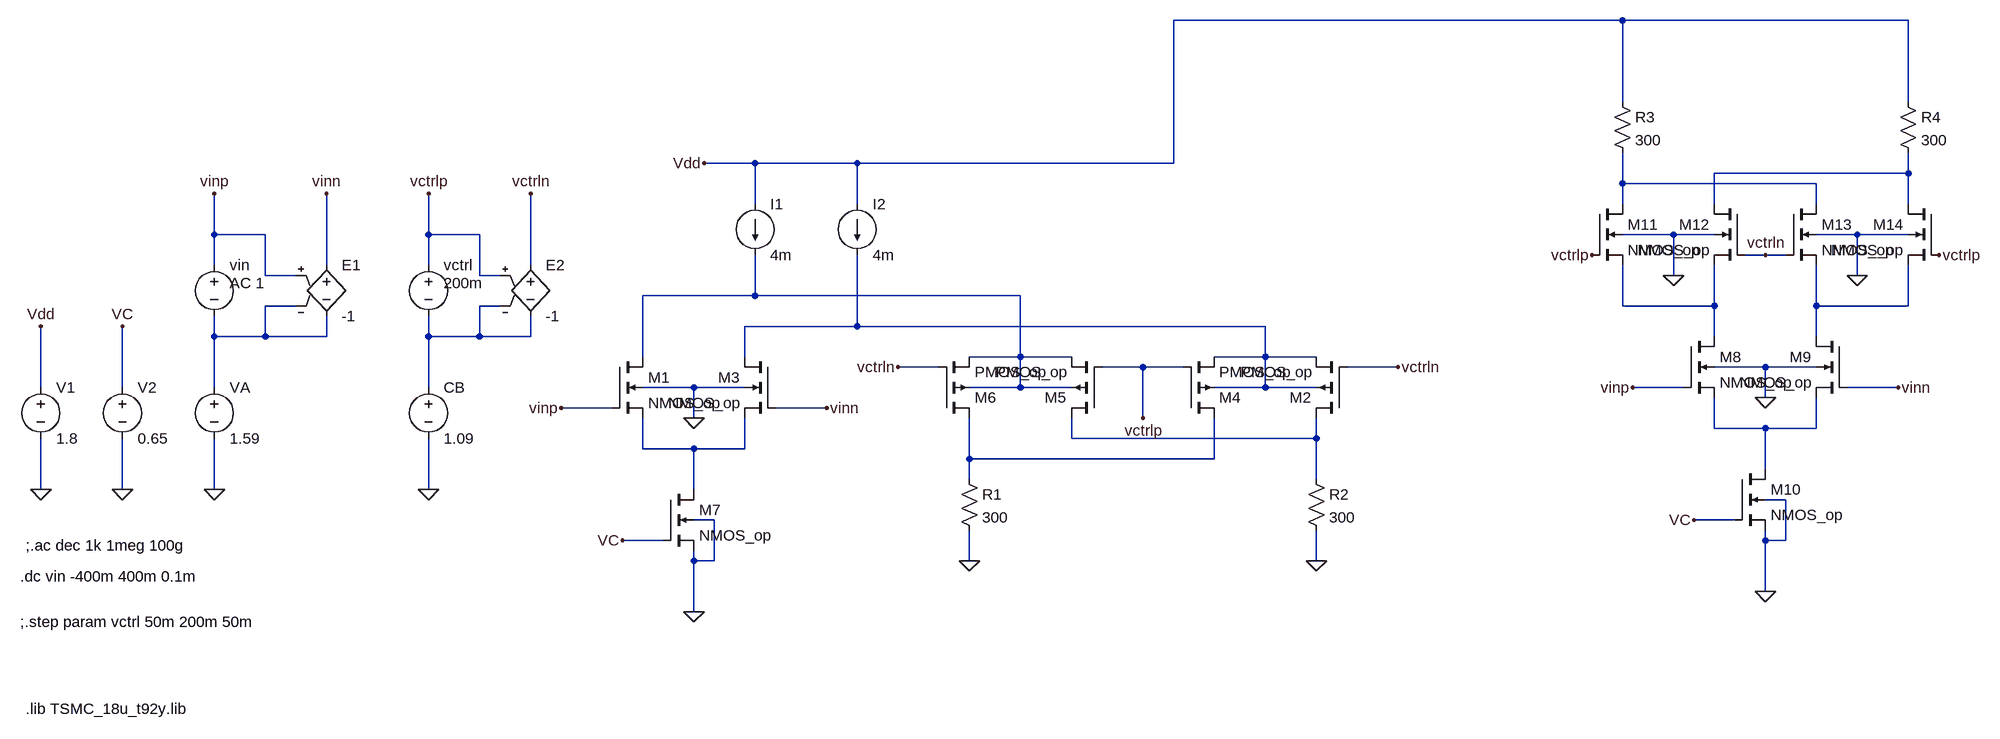
[diagram p0: schematic Draft1.asc]
Draft1.asc, the LTspice schematic file:
Version 4
SHEET 1 2292 680
WIRE 1648 -432 944 -432
WIRE 2096 -432 1648 -432
WIRE 1648 -304 1648 -432
WIRE 2096 -304 2096 -432
WIRE 288 -208 208 -208
WIRE 448 -208 288 -208
WIRE 944 -208 944 -432
WIRE 944 -208 448 -208
WIRE 2096 -192 2096 -224
WIRE 2096 -192 1792 -192
WIRE 1648 -176 1648 -224
WIRE 1952 -176 1648 -176
WIRE 288 -144 288 -208
WIRE 448 -144 448 -208
WIRE 1648 -144 1648 -176
WIRE 1792 -144 1792 -192
WIRE 1952 -144 1952 -176
WIRE 2096 -144 2096 -192
WIRE -560 -96 -560 -160
WIRE -480 -96 -560 -96
WIRE -224 -96 -224 -160
WIRE -144 -96 -224 -96
WIRE 1728 -96 1648 -96
WIRE 1792 -96 1728 -96
WIRE 2016 -96 1952 -96
WIRE 2096 -96 2016 -96
WIRE 1872 -64 1840 -64
WIRE 1904 -64 1872 -64
WIRE -560 -48 -560 -96
WIRE -384 -48 -384 -160
WIRE -224 -48 -224 -96
WIRE -64 -48 -64 -160
WIRE -480 -32 -480 -96
WIRE -432 -32 -480 -32
WIRE -144 -32 -144 -96
WIRE -112 -32 -144 -32
WIRE 1728 -32 1728 -96
WIRE 2016 -32 2016 -96
WIRE 288 0 288 -64
WIRE 288 0 112 0
WIRE 704 0 288 0
WIRE -432 16 -480 16
WIRE -112 16 -144 16
WIRE 1648 16 1648 -48
WIRE 1792 16 1792 -48
WIRE 1792 16 1648 16
WIRE 1952 16 1952 -48
WIRE 2096 16 2096 -48
WIRE 2096 16 1952 16
WIRE 448 48 448 -64
WIRE 448 48 272 48
WIRE 1088 48 448 48
WIRE -560 64 -560 32
WIRE -480 64 -480 16
WIRE -480 64 -560 64
WIRE -384 64 -384 32
WIRE -384 64 -480 64
WIRE -224 64 -224 32
WIRE -144 64 -144 16
WIRE -144 64 -224 64
WIRE -64 64 -64 32
WIRE -64 64 -144 64
WIRE 1792 64 1792 16
WIRE 1952 64 1952 16
WIRE 112 96 112 0
WIRE 272 96 272 48
WIRE 704 96 704 0
WIRE 704 96 624 96
WIRE 784 96 704 96
WIRE 1088 96 1088 48
WIRE 1088 96 1008 96
WIRE 1168 96 1088 96
WIRE 576 112 512 112
WIRE 896 112 832 112
WIRE 960 112 896 112
WIRE 1296 112 1216 112
WIRE 1872 112 1792 112
WIRE 1952 112 1872 112
WIRE -832 144 -832 48
WIRE -704 144 -704 48
WIRE -560 144 -560 64
WIRE -224 144 -224 64
WIRE 192 144 112 144
WIRE 272 144 192 144
WIRE 704 144 704 96
WIRE 704 144 624 144
WIRE 784 144 704 144
WIRE 1088 144 1088 96
WIRE 1088 144 1008 144
WIRE 1168 144 1088 144
WIRE 1744 144 1664 144
WIRE 2080 144 2000 144
WIRE 1872 160 1872 112
WIRE 64 176 -16 176
WIRE 400 176 320 176
WIRE 192 192 192 144
WIRE 896 192 896 112
WIRE 1792 208 1792 160
WIRE 1872 208 1792 208
WIRE 1952 208 1952 160
WIRE 1952 208 1872 208
WIRE 784 224 784 192
WIRE 1168 224 1168 192
WIRE 1168 224 784 224
WIRE 112 240 112 192
WIRE 192 240 112 240
WIRE 272 240 272 192
WIRE 272 240 192 240
WIRE 624 256 624 192
WIRE 1008 256 1008 192
WIRE 1008 256 624 256
WIRE 1872 272 1872 208
WIRE 624 288 624 256
WIRE 1168 288 1168 224
WIRE -832 304 -832 224
WIRE -704 304 -704 224
WIRE -560 304 -560 224
WIRE -224 304 -224 224
WIRE 192 304 192 240
WIRE 1904 320 1872 320
WIRE 224 352 192 352
WIRE 1824 352 1760 352
WIRE 144 384 80 384
WIRE 1872 384 1872 368
WIRE 1904 384 1904 320
WIRE 1904 384 1872 384
WIRE 192 416 192 400
WIRE 224 416 224 352
WIRE 224 416 192 416
WIRE 624 416 624 368
WIRE 1168 416 1168 368
WIRE 1872 464 1872 384
WIRE 192 496 192 416
FLAG 192 192 0
FLAG 624 416 0
FLAG 1168 416 0
FLAG 192 496 0
FLAG -832 304 0
FLAG -560 304 0
FLAG -224 304 0
FLAG -832 48 Vdd
FLAG 208 -208 Vdd
FLAG -560 -160 vinp
FLAG -16 176 vinp
FLAG -384 -160 vinn
FLAG 400 176 vinn
FLAG -224 -160 vctrlp
FLAG -64 -160 vctrln
FLAG 896 192 vctrlp
FLAG 512 112 vctrln
FLAG 1296 112 vctrln
FLAG -704 304 0
FLAG -704 48 VC
FLAG 80 384 VC
FLAG 1872 160 0
FLAG 1872 464 0
FLAG 1664 144 vinp
FLAG 2080 144 vinn
FLAG 1760 352 VC
FLAG 1600 -64 vctrlp
FLAG 1872 -64 vctrln
FLAG 2144 -64 vctrlp
FLAG 1728 -32 0
FLAG 2016 -32 0
SYMBOL nmos4 64 96 R0
SYMATTR InstName M1
SYMATTR Value2 l=0.72u w=4.27u m=20
SYMATTR Value NMOS_op
SYMBOL pmos4 1216 192 R180
SYMATTR InstName M2
SYMATTR Value2 l=0.72u w=20u m=10
SYMATTR Value PMOS_op
SYMBOL nmos4 320 96 M0
SYMATTR InstName M3
SYMATTR Value2 l=0.72u w=4.27u m=20
SYMATTR Value NMOS_op
SYMBOL pmos4 960 192 M180
SYMATTR InstName M4
SYMATTR Value2 l=0.72u w=20u m=10
SYMATTR Value PMOS_op
SYMBOL pmos4 832 192 R180
SYMATTR InstName M5
SYMATTR Value2 l=0.72u w=20u m=10
SYMATTR Value PMOS_op
SYMBOL pmos4 576 192 M180
SYMATTR InstName M6
SYMATTR Value2 l=0.72u w=20u m=10
SYMATTR Value PMOS_op
SYMBOL res 608 272 R0
SYMATTR InstName R1
SYMATTR Value 300
SYMBOL res 1152 272 R0
SYMATTR InstName R2
SYMATTR Value 300
SYMBOL current 288 -144 R0
WINDOW 123 0 0 Left 0
WINDOW 39 0 0 Left 0
SYMATTR InstName I1
SYMATTR Value 4m
SYMBOL current 448 -144 R0
WINDOW 123 0 0 Left 0
WINDOW 39 0 0 Left 0
SYMATTR InstName I2
SYMATTR Value 4m
SYMBOL voltage -832 128 R0
WINDOW 123 0 0 Left 0
WINDOW 39 0 0 Left 0
SYMATTR InstName V1
SYMATTR Value 1.8
SYMBOL voltage -560 128 R0
WINDOW 123 0 0 Left 0
WINDOW 39 0 0 Left 0
SYMATTR InstName VA
SYMATTR Value 1.59
SYMBOL voltage -224 128 R0
WINDOW 123 0 0 Left 0
WINDOW 39 0 0 Left 0
SYMATTR InstName CB
SYMATTR Value 1.09
SYMBOL voltage -560 -64 R0
WINDOW 123 24 44 Left 2
WINDOW 39 0 0 Left 0
SYMATTR Value2 AC 1
SYMATTR InstName vin
SYMATTR Value ""
SYMBOL voltage -224 -64 R0
WINDOW 3 24 44 Left 2
WINDOW 123 0 0 Left 0
WINDOW 39 0 0 Left 0
SYMATTR Value 200m
SYMATTR InstName vctrl
SYMBOL e -384 -64 R0
SYMATTR InstName E1
SYMATTR Value -1
SYMBOL e -64 -64 R0
SYMATTR InstName E2
SYMATTR Value -1
SYMBOL nmos4 144 304 R0
SYMATTR InstName M7
SYMATTR Value2 l=0.72u w=11.6u m=40
SYMATTR Value NMOS_op
SYMBOL voltage -704 128 R0
WINDOW 123 0 0 Left 0
WINDOW 39 0 0 Left 0
SYMATTR InstName V2
SYMATTR Value 0.65
SYMBOL nmos4 1744 64 R0
SYMATTR InstName M8
SYMATTR Value2 l=0.72u w=4.27u m=20
SYMATTR Value NMOS_op
SYMBOL nmos4 2000 64 M0
SYMATTR InstName M9
SYMATTR Value2 l=0.72u w=4.27u m=20
SYMATTR Value NMOS_op
SYMBOL nmos4 1824 272 R0
SYMATTR InstName M10
SYMATTR Value2 l=0.72u w=11.6u m=40
SYMATTR Value NMOS_op
SYMBOL nmos4 1600 -144 R0
SYMATTR InstName M11
SYMATTR Value2 l=0.72u w=4.27u m=10
SYMATTR Value NMOS_op
SYMBOL nmos4 1840 -144 M0
SYMATTR InstName M12
SYMATTR Value2 l=0.72u w=4.27u m=10
SYMATTR Value NMOS_op
SYMBOL nmos4 1904 -144 R0
SYMATTR InstName M13
SYMATTR Value2 l=0.72u w=4.27u m=10
SYMATTR Value NMOS_op
SYMBOL nmos4 2144 -144 M0
SYMATTR InstName M14
SYMATTR Value2 l=0.72u w=4.27u m=10
SYMATTR Value NMOS_op
SYMBOL res 1632 -320 R0
SYMATTR InstName R3
SYMATTR Value 300
SYMBOL res 2080 -320 R0
SYMATTR InstName R4
SYMATTR Value 300
TEXT -864 440 Left 2 !.dc vin -400m 400m 0.1m
TEXT -864 512 Left 2 !;.step param vctrl 50m 200m 50m
TEXT -856 392 Left 2 !;.ac dec 1k 1meg 100g
TEXT -856 648 Left 2 !.lib TSMC_18u_t92y.lib

The netlist it stands for:
* Draft1.asc
M1 N003 vinp N011 0 NMOS_op l=0.72u w=4.27u m=20
M2 N010 vctrln N008 N008 PMOS_op l=0.72u w=20u m=10
M3 N008 vinn N011 0 NMOS_op l=0.72u w=4.27u m=20
M4 N012 vctrlp N008 N008 PMOS_op l=0.72u w=20u m=10
M5 N010 vctrlp N003 N003 PMOS_op l=0.72u w=20u m=10
M6 N012 vctrln N003 N003 PMOS_op l=0.72u w=20u m=10
R1 N012 0 300
R2 N010 0 300
I1 Vdd N003 4m
I2 Vdd N008 4m
V1 Vdd 0 1.8
VA N004 0 1.59
V§CB N005 0 1.09
vin vinp N004 AC 1
vctrl vctrlp N005 200m
E1 vinn N004 vinp N004 -1
E2 vctrln N005 vctrlp N005 -1
M7 N011 VC 0 0 NMOS_op l=0.72u w=11.6u m=40
V2 VC 0 0.65
M8 N006 vinp N009 0 NMOS_op l=0.72u w=4.27u m=20
M9 N007 vinn N009 0 NMOS_op l=0.72u w=4.27u m=20
M10 N009 VC 0 0 NMOS_op l=0.72u w=11.6u m=40
M11 N002 vctrlp N006 0 NMOS_op l=0.72u w=4.27u m=10
M12 N001 vctrln N006 0 NMOS_op l=0.72u w=4.27u m=10
M13 N002 vctrln N007 0 NMOS_op l=0.72u w=4.27u m=10
M14 N001 vctrlp N007 0 NMOS_op l=0.72u w=4.27u m=10
R3 Vdd N002 300
R4 Vdd N001 300
.model NMOS NMOS
.model PMOS PMOS
.lib standard.mos
.dc vin -400m 400m 0.1m
;.step param vctrl 50m 200m 50m
;.ac dec 1k 1meg 100g
.lib TSMC_18u_t92y.lib
.backanno
.end